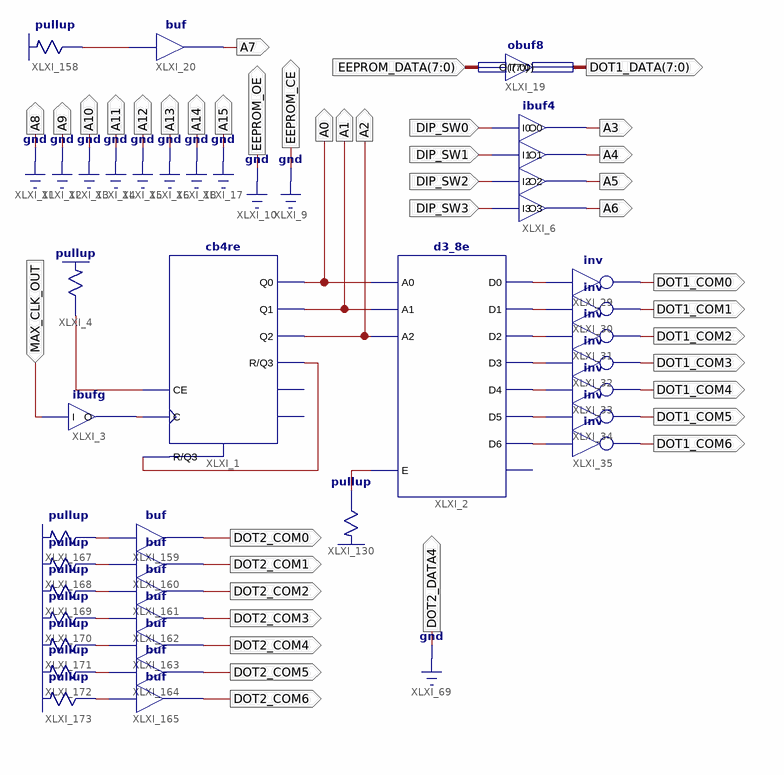
[diagram p0: schematic sheet 1]
// Xilinx ISE schematic lab9_romext2.sch (spartan3) as structural Verilog: 30 symbols, 40 ports
module lab9_romext2 (
  input  [7:0] EEPROM_DATA,
  input  MAX_CLK_OUT,
  input  DIP_SW0,
  input  DIP_SW1,
  input  DIP_SW2,
  input  DIP_SW3,
  output A7,
  output A8,
  output A9,
  output A10,
  output A11,
  output A12,
  output A13,
  output A14,
  output A15,
  output [7:0] DOT1_DATA,
  output DOT2_COM0,
  output DOT2_COM1,
  output DOT2_COM2,
  output DOT2_COM3,
  output A0,
  output A1,
  output A2,
  output DOT1_COM6,
  output DOT1_COM5,
  output DOT1_COM4,
  output DOT1_COM3,
  output DOT1_COM2,
  output DOT1_COM1,
  output DOT1_COM0,
  output A3,
  output A5,
  output A4,
  output A6,
  output EEPROM_OE,
  output EEPROM_CE,
  output DOT2_COM4,
  output DOT2_COM5,
  output DOT2_COM6,
  output DOT2_DATA4
);

  wire DIP_SW7, XLXN_56, XLXN_57, XLXN_58, XLXN_59, XLXN_60, XLXN_61, XLXN_62, XLXN_154, XLXN_341, XLXN_342,
       XLXN_385, XLXN_447, XLXN_448, XLXN_449, XLXN_450, XLXN_451, XLXN_452, XLXN_453;

  buf XLXI_20 (A7, DIP_SW7);
  \pullup  XLXI_158 (.O(DIP_SW7));
  obuf8 XLXI_19 (.I(EEPROM_DATA), .O(DOT1_DATA));
  ibufg XLXI_3 (.I(MAX_CLK_OUT), .O(XLXN_341));
  \pullup  XLXI_4 (.O(XLXN_342));
  \pullup  XLXI_130 (.O(XLXN_154));
  cb4re XLXI_1 (.C(XLXN_341), .CE(XLXN_342), .R(XLXN_385), .Q0(A0), .Q1(A1), .Q2(A2), .Q3(XLXN_385));  // open: CEO, TC
  d3_8e XLXI_2 (
    .A0(A0), .A1(A1), .A2(A2), .E(XLXN_154), .D0(XLXN_56), .D1(XLXN_57), .D2(XLXN_58), .D3(XLXN_59),
    .D4(XLXN_60), .D5(XLXN_61), .D6(XLXN_62));  // open: D7
  not XLXI_35 (DOT1_COM6, XLXN_62);
  not XLXI_34 (DOT1_COM5, XLXN_61);
  not XLXI_33 (DOT1_COM4, XLXN_60);
  not XLXI_32 (DOT1_COM3, XLXN_59);
  not XLXI_31 (DOT1_COM2, XLXN_58);
  not XLXI_30 (DOT1_COM1, XLXN_57);
  not XLXI_29 (DOT1_COM0, XLXN_56);
  ibuf4 XLXI_6 (.I0(DIP_SW0), .I1(DIP_SW1), .I2(DIP_SW2), .I3(DIP_SW3), .O0(A3), .O1(A4), .O2(A5), .O3(A6));
  buf XLXI_159 (DOT2_COM0, XLXN_447);
  buf XLXI_160 (DOT2_COM1, XLXN_448);
  buf XLXI_161 (DOT2_COM2, XLXN_449);
  buf XLXI_162 (DOT2_COM3, XLXN_450);
  buf XLXI_163 (DOT2_COM4, XLXN_451);
  buf XLXI_164 (DOT2_COM5, XLXN_452);
  buf XLXI_165 (DOT2_COM6, XLXN_453);
  \pullup  XLXI_167 (.O(XLXN_447));
  \pullup  XLXI_168 (.O(XLXN_448));
  \pullup  XLXI_169 (.O(XLXN_449));
  \pullup  XLXI_170 (.O(XLXN_450));
  \pullup  XLXI_171 (.O(XLXN_451));
  \pullup  XLXI_172 (.O(XLXN_452));
  \pullup  XLXI_173 (.O(XLXN_453));

  assign A8 = 1'b0;
  assign A9 = 1'b0;
  assign A10 = 1'b0;
  assign A11 = 1'b0;
  assign A12 = 1'b0;
  assign A13 = 1'b0;
  assign A14 = 1'b0;
  assign A15 = 1'b0;
  assign DOT2_DATA4 = 1'b0;
  assign EEPROM_CE = 1'b0;
  assign EEPROM_OE = 1'b0;
endmodule
